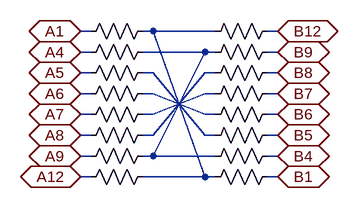
[diagram p0: schematic USB_C_16_Pin_Custom.asc]
USB_C_16_Pin_Custom.asc, the LTspice schematic file:
Version 4.1
SHEET 1 880 680
WIRE 0 112 -16 112
WIRE 96 112 80 112
WIRE 192 112 96 112
WIRE 288 112 272 112
WIRE 0 144 -16 144
WIRE 176 144 80 144
WIRE 192 144 176 144
WIRE 288 144 272 144
WIRE 0 176 -16 176
WIRE 96 176 80 176
WIRE 192 176 176 176
WIRE 288 176 272 176
WIRE 0 208 -16 208
WIRE 96 208 80 208
WIRE 192 208 176 208
WIRE 288 208 272 208
WIRE 0 240 -16 240
WIRE 96 240 176 208
WIRE 96 240 80 240
WIRE 176 240 96 208
WIRE 192 240 176 240
WIRE 288 240 272 240
WIRE 0 272 -16 272
WIRE 96 272 176 176
WIRE 96 272 80 272
WIRE 176 272 96 176
WIRE 192 272 176 272
WIRE 288 272 272 272
WIRE 0 304 -16 304
WIRE 96 304 176 144
WIRE 96 304 80 304
WIRE 192 304 96 304
WIRE 288 304 272 304
WIRE 0 336 -16 336
WIRE 176 336 96 112
WIRE 176 336 80 336
WIRE 192 336 176 336
WIRE 288 336 272 336
FLAG -16 112 A1
IOPIN -16 112 BiDir
FLAG -16 144 A4
IOPIN -16 144 BiDir
FLAG -16 176 A5
IOPIN -16 176 BiDir
FLAG -16 208 A6
IOPIN -16 208 BiDir
FLAG -16 240 A7
IOPIN -16 240 BiDir
FLAG -16 272 A8
IOPIN -16 272 BiDir
FLAG -16 304 A9
IOPIN -16 304 BiDir
FLAG -16 336 A12
IOPIN -16 336 BiDir
FLAG 288 336 B1
IOPIN 288 336 BiDir
FLAG 288 304 B4
IOPIN 288 304 BiDir
FLAG 288 272 B5
IOPIN 288 272 BiDir
FLAG 288 240 B6
IOPIN 288 240 BiDir
FLAG 288 208 B7
IOPIN 288 208 BiDir
FLAG 288 176 B8
IOPIN 288 176 BiDir
FLAG 288 144 B9
IOPIN 288 144 BiDir
FLAG 288 112 B12
IOPIN 288 112 BiDir
SYMBOL res 96 96 R90
WINDOW 0 0 56 Invisible 2
WINDOW 3 32 56 Invisible 2
SYMATTR InstName R1
SYMATTR Value 1m
SYMBOL res 96 128 R90
WINDOW 0 0 56 Invisible 2
WINDOW 3 32 56 Invisible 2
SYMATTR InstName R2
SYMATTR Value 1m
SYMBOL res 96 288 R90
WINDOW 0 0 56 Invisible 2
WINDOW 3 32 56 Invisible 2
SYMATTR InstName R3
SYMATTR Value 1m
SYMBOL res 96 320 R90
WINDOW 0 0 56 Invisible 2
WINDOW 3 32 56 Invisible 2
SYMATTR InstName R4
SYMATTR Value 1m
SYMBOL res 96 160 R90
WINDOW 0 0 56 Invisible 2
WINDOW 3 32 56 Invisible 2
SYMATTR InstName R5
SYMATTR Value 1m
SYMBOL res 96 192 R90
WINDOW 0 0 56 Invisible 2
WINDOW 3 32 56 Invisible 2
SYMATTR InstName R6
SYMATTR Value 1m
SYMBOL res 96 224 R90
WINDOW 0 0 56 Invisible 2
WINDOW 3 32 56 Invisible 2
SYMATTR InstName R7
SYMATTR Value 1m
SYMBOL res 96 256 R90
WINDOW 0 0 56 Invisible 2
WINDOW 3 32 56 Invisible 2
SYMATTR InstName R8
SYMATTR Value 1m
SYMBOL res 288 96 R90
WINDOW 0 0 56 Invisible 2
WINDOW 3 32 56 Invisible 2
SYMATTR InstName R9
SYMATTR Value 1m
SYMBOL res 288 128 R90
WINDOW 0 0 56 Invisible 2
WINDOW 3 32 56 Invisible 2
SYMATTR InstName R10
SYMATTR Value 1m
SYMBOL res 288 288 R90
WINDOW 0 0 56 Invisible 2
WINDOW 3 32 56 Invisible 2
SYMATTR InstName R11
SYMATTR Value 1m
SYMBOL res 288 320 R90
WINDOW 0 0 56 Invisible 2
WINDOW 3 32 56 Invisible 2
SYMATTR InstName R12
SYMATTR Value 1m
SYMBOL res 288 160 R90
WINDOW 0 0 56 Invisible 2
WINDOW 3 32 56 Invisible 2
SYMATTR InstName R13
SYMATTR Value 1m
SYMBOL res 288 192 R90
WINDOW 0 0 56 Invisible 2
WINDOW 3 32 56 Invisible 2
SYMATTR InstName R14
SYMATTR Value 1m
SYMBOL res 288 224 R90
WINDOW 0 0 56 Invisible 2
WINDOW 3 32 56 Invisible 2
SYMATTR InstName R15
SYMATTR Value 1m
SYMBOL res 288 256 R90
WINDOW 0 0 56 Invisible 2
WINDOW 3 32 56 Invisible 2
SYMATTR InstName R16
SYMATTR Value 1m

The netlist it stands for:
* USB_C_16_Pin_Custom.asc
R1 N001 A1 1m
R2 N002 A4 1m
R3 N002 A9 1m
R4 N001 A12 1m
R5 N003 A5 1m
R6 N005 A6 1m
R7 N006 A7 1m
R8 N004 A8 1m
R9 B12 N001 1m
R10 B9 N002 1m
R11 B4 N002 1m
R12 B1 N001 1m
R13 B8 N004 1m
R14 B7 N006 1m
R15 B6 N005 1m
R16 B5 N003 1m
.backanno
.end